# EAGLE design ctr_p1 (EAGLE 9.6.2)
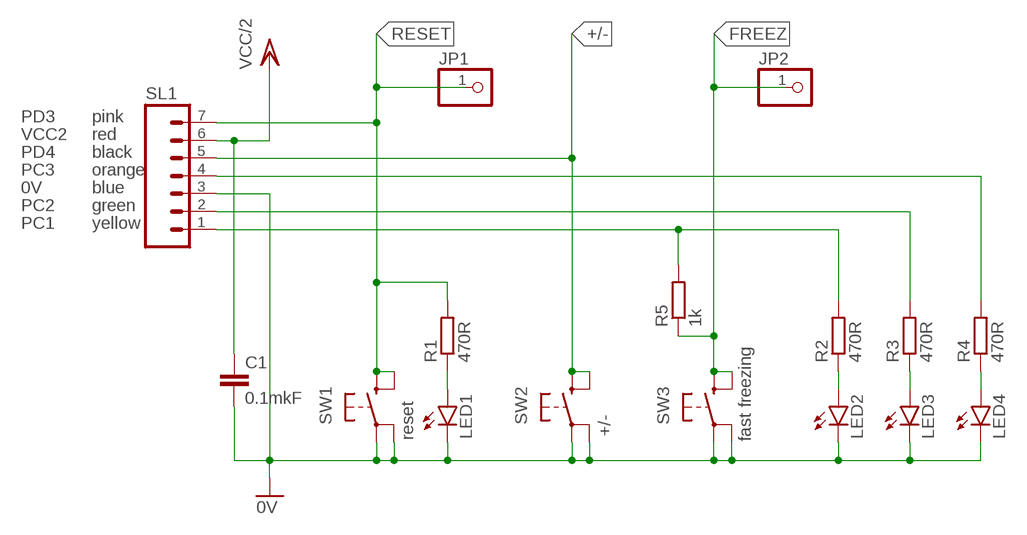
[diagram p0: schematic, sheet 1]

## Parts
C1  0.1mkF  C-EUC3225  [C3225]
JP1  PINHD-1X1  [1X01]
JP2  PINHD-1X1  [1X01]
LED1  LED3MM  [LED3MM]
LED2  LED3MM  [LED3MM]
LED3  LED3MM  [LED3MM]
LED4  LED3MM  [LED3MM]
R1  470R  R-EU_R0805  [R0805]
R2  470R  R-EU_R0805  [R0805]
R3  470R  R-EU_R0805  [R0805]
R4  470R  R-EU_R0805  [R0805]
R5  1k  R-EU_R0805  [R0805]
SL1  MA07  [07PA]
SW1  reset  PUSH_BUTTON_25X6MM  [SWITCH]
SW2  +/-  PUSH_BUTTON_25X6MM  [SWITCH]
SW3  fast freezing  PUSH_BUTTON_25X6MM  [SWITCH]

## Nets
0V: C1.2 LED1.K(C) LED2.K(C) LED3.K(C) LED4.K(C) SL1.3 SW1.P$1A(P) SW1.P$2A(P1) SW2.P$1A(P) SW2.P$2A(P1) SW3.P$1A(P) SW3.P$2A(P1)
+/-: SL1.5 SW2.P$1B(S) SW2.P$2B(S1)
FREEZ: JP2.1 R5.1 SW3.P$1B(S) SW3.P$2B(S1)
N$1: LED2.A R2.1
N$2: LED3.A R3.1
N$3: LED4.A R4.1
N$6: R2.2 R5.2 SL1.1
N$8: R3.2 SL1.2
N$9: R4.2 SL1.4
N$10: LED1.A R1.1
RESET: JP1.1 R1.2 SL1.7 SW1.P$1B(S) SW1.P$2B(S1)
VCC/2: C1.1 SL1.6

## Notes on the sheet
- PD3 | pink
- VCC2 | red
- PD4 | black
- PC3 | orange
- 0V | blue
- PC2 | green
- PC1 | yellow

## Library data of the parts
C1 = rcl:C-EU: CAPACITOR, European symbol; SPICEPREFIX: C
JP1 JP2 = pinhead:PINHD-1X1: PIN HEADER
LED1-LED4 = OU_USSR:LED: LED OSRAM: - CHIPLED LG R971, LG N971, LY N971, LG Q971, LY Q971, LO R971, LY R971 LH N974, LH R974 LS Q976, LO Q976, LY Q976 LO Q996 - Hyper CHIPLED LW Q18S LB Q993, LB Q99A, LB R99A - SideLED LS A670, LO A670, LY A670, LG A670, LP A670 LB A673, LV A673, LT A673, LW A673 LH A674 LY A675 LS A676, LA A676, LO A676, LY A676, LW A676 LS A679, LY A679, LG A679 - Hyper Micro SIDELED® LS Y876, LA Y876, LO Y876, LY Y876 LT Y87S - SmartLED LW L88C, LW L88S LB L89C, LB L89S, LG L890 LS L89K, LO L89K, LY L89K LS L896, LA L896, LO L896, LY L896 - TOPLED LS T670, LO T670, LY T670, LG T670, LP T670 LSG T670, LSP T670, LSY T670, LOP T670, LYG T670 LG T671, LOG T671, LSG T671 LB T673, LV T673, LT T673, LW T673 LH T674 LS T676, LA T676, LO T676, LY T676, LB T676, LH T676, LSB T676, LW T676 LB T67C, LV T67C, LT T67C, LS T67K, LO T67K, LY T67K, LW E67C LS E67B, LA E67B, LO E67B, LY E67B, LB E67C, LV E67C, LT E67C LW T67C LS T679, LY T679, LG T679 LS T770, LO T770, LY T770, LG T770, LP T770 LB T773, LV T773, LT T773, LW T773 LH T774 LS E675, LA E675, LY E675, LS T675 LS T776, LA T776, LO T776, LY T776, LB T776 LHGB T686 LT T68C, LB T68C - Hyper Mini TOPLED® LB M676 - Mini TOPLED Santana® LG M470 LS M47K, LO M47K, LY M47K Source: http://www.osram.convergy.de LUXEON: - LUMILED® LXK2-PW12-R00, LXK2-PW12-S00, LXK2-PW14-U00, LXK2-PW14-V00 LXK2-PM12-R00, LXK2-PM12-S00, LXK2-PM14-U00 LXK2-PE12-Q00, LXK2-PE12-R00, LXK2-PE12-S00, LXK2-PE14-T00, LXK2-PE14-U00 LXK2-PB12-K00, LXK2-PB12-L00, LXK2-PB12-M00, LXK2-PB14-N00, LXK2-PB14-P00, LXK2-PB14-Q00 LXK2-PR12-L00, LXK2-PR12-M00, LXK2-PR14-Q00, LXK2-PR14-R00 LXK2-PD12-Q00, LXK2-PD12-R00, LXK2-PD12-S00 LXK2-PH12-R00, LXK2-PH12-S00 LXK2-PL12-P00, LXK2-PL12-Q00, LXK2-PL12-R00 Source: www.luxeon.com KINGBRIGHT: KA-3528ASYC Source: www.kingbright.com
R1-R5 = rcl:R-EU_: RESISTOR, European symbol; SPICEPREFIX: R
SL1 = con-amp-quick:MA07: AMP QUICK CONNECTOR; OC_FARNELL: unknown; OC_NEWARK: unknown
SW1-SW3 = OU_USSR:PUSH_BUTTON_2: momentary push button

## Board
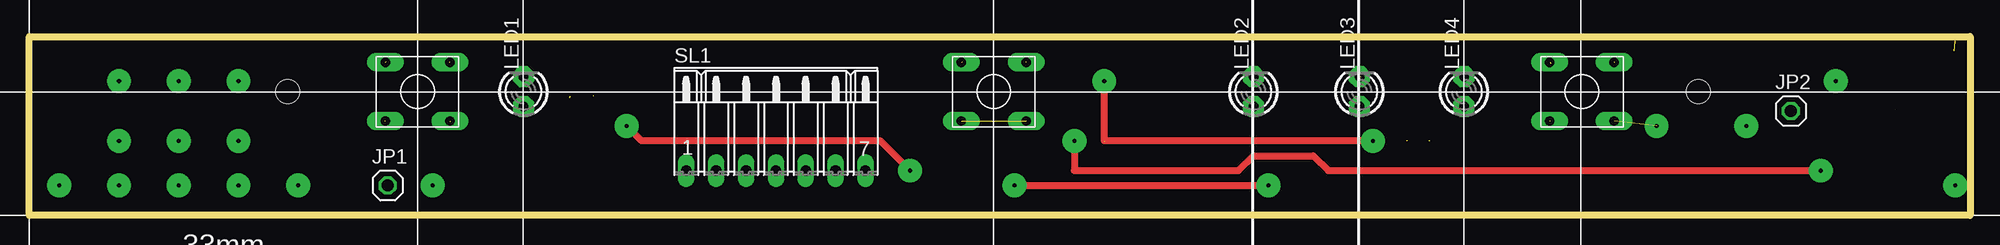
[diagram p1: board, top side]
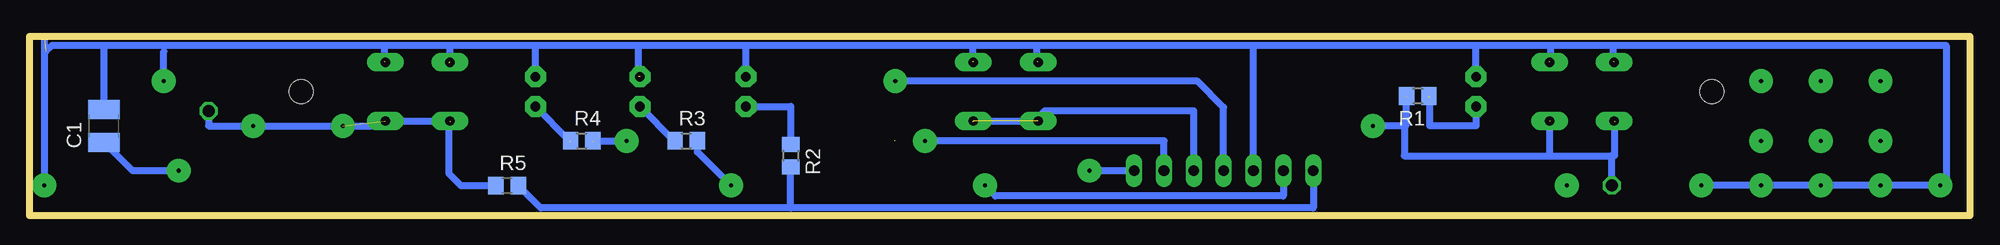
[diagram p2: board, bottom side, seen from below]

Size 165.1 x 15.24 mm. Coordinates in mm from the lower left corner, seen from the top.
Outline: 165.1,15.24 0,15.23 0,0
Outline: 165.1,15.24 0,15.24 0,0
Outline: 165.1,15.24 165.1,0 0,0
Copper layers (1*16): Top 0.035mm / dielectric 1.5mm / Bottom 0.035mm
Design rules "default": minimum track width 6mil, minimum drill 0.35mm, track to track 6mil, track to pad 6mil, pad to pad 6mil, via to via 6mil, smd to smd 6mil, copper to edge 40mil, drill to drill 6mil, minimum pad ring 10mil, minimum via ring 8mil, stop-mask expansion 4mil, vias tented up to drill 0mil, thermal gap 10mil
Holes 2.03 mm at 21.97,10.54 141.99,10.54

### Footprints (pad centres in the part's own frame; a part is rotated, then mirrored left to right if it is on the bottom)
C3225 = smd 1.6 x 2.7: 1 -1.4,0; 2 1.4,0
1X01 = drill 1.016 octagon: 1 0,0
LED3MM = drill 0.813 pad 1.778 octagon: A -1.27,0; K 1.27,0
R0805 = smd 1.3 x 1.5: 1 -0.95,0; 2 0.95,0
07PA = drill 0.914 long: 1 -7.62,0; 2 -5.08,0; 3 -2.54,0; 4 0,0; 5 2.54,0; 6 5.08,0; 7 7.62,0
SWITCH = drill 0.8 pad 1.575 long: P$1A -2.75,2.5; P$1B -2.75,-2.5; P$2A 2.75,2.5; P$2B 2.75,-2.5

### Placement (x,y rotation side)
C1  158.75,7.62 90 bottom
JP1  30.48,2.54 0 top
JP2  149.86,8.89 0 top
LED1  42.04,10.54 90 top
LED2  104.14,10.54 90 top
LED3  113.16,10.54 90 top
LED4  122.05,10.54 90 top
R1  46.99,10.16 180 bottom
R2  100.33,5.08 270 bottom
R3  109.22,6.35 0 bottom
R4  118.11,6.35 0 bottom
R5  124.46,2.54 0 bottom
SL1  63.5,3.81 0 top
SW1  33.02,10.54 0 top
SW2  82.04,10.54 0 top
SW3  132.08,10.54 0 top

### Tracks (layer width: path | path; a pad name or v marks a point on that pad's centre or on a via)
0V  (via drill 0.35 pad 2.03)  (9 unrouted)
  Bottom 0.61: 30.35,14.48 2.03,14.48 2.03,2.54 v2.54,2.54 v7.62,2.54 v12.7,2.54 v17.78,2.54 v22.86,2.54 | 30.35,14.48 35.69,14.48 | 35.69,14.48 42.04,14.48 | 42.04,14.48 60.96,14.48 | 60.96,14.48 79.38,14.48 | 79.38,14.48 84.84,14.48 | 84.84,14.48 104.14,14.48 | 104.14,14.48 113.28,14.48 | 113.28,14.48 122.05,14.48 | 122.05,14.48 129.29,14.48 | 129.29,14.48 134.87,14.48 | 134.87,14.48 158.75,14.48 | 158.75,14.48 163.19,14.48 163.7,13.97 | LED1.K 42.04,14.48 | LED2.K 104.14,14.48 | 113.28,11.81 113.28,14.48 | LED4.K 122.05,14.48 | 30.35,13.08 30.35,14.48 | 35.81,13.08 35.69,13.21 35.69,14.48 | 79.38,13.08 79.38,14.48 | 84.84,13.08 84.84,14.48 | 129.41,12.95 129.29,13.08 129.29,14.48 | 134.87,13.08 134.87,14.48 | SL1.3 60.96,14.48 | C1.2 158.75,14.48 | 163.83,15.24 v163.83,2.54
+/-  (2 unrouted)
  Bottom 0.61: SL1.5 66.04,8.89 78.74,8.89 79.38,8.26 79.38,8 84.84,8
FREEZ  (via drill 0.35 pad 2.03)  (2 unrouted)
  Bottom 0.61: JP2.1 149.86,7.62 v146.05,7.62 v138.43,7.62 135.25,7.62 134.87,8 129.41,8 | 129.29,8 129.41,8 | 129.41,8 129.41,3.56 128.4,2.54 R5.1
N$1
  Bottom 0.61: LED2.A 100.33,9.27 R2.1
N$2
  Bottom 0.61: LED3.A 110.24,6.35 R3.1
N$3  (1 unrouted)
  Bottom 0.61: 119.13,6.35 119,6.48 119.25,6.48 LED4.A
N$4  (via drill 0.35 pad 2.03)
  Bottom 0.61: v153.67,11.43 153.67,13.97
N$5  (via drill 0.35 pad 2.03)
  other vias: 34.29,2.54
N$6
  Bottom 0.61: SL1.1 55.88,0.64 100.33,0.64 | 100.33,0.64 121.61,0.64 R5.2 | 100.33,0.64 R2.2
N$7  (via drill 0.35 pad 2.03)
  other vias: 7.62,11.43
N$8  (via drill 0.35 pad 2.03)
  Top 0.61: v83.82,2.54 v105.41,2.54
  Bottom 0.61: SL1.2 58.42,1.65 82.93,1.65 v83.82,2.54 | v105.41,2.54 108.27,5.4 R3.2
N$9  (via drill 0.35 pad 2.03)  (2 unrouted)
  Top 0.61: v114.3,6.35 91.49,6.35 | 91.44,6.35 v91.44,11.43
  Bottom 0.61: 117.22,6.35 v114.3,6.35 | SL1.4 63.5,9.21 65.72,11.43 v91.44,11.43
N$10  (1 unrouted)
  Bottom 0.61: LED1.A 42.04,7.62 42.16,7.62 45.97,7.62 45.97,10.03
N$11  (via drill 0.35 pad 2.03)
  other vias: 12.7,11.43
N$12  (via drill 0.35 pad 2.03)
  other vias: 17.78,11.43
N$13  (via drill 0.35 pad 2.03)
  other vias: 7.62,6.35
N$14  (via drill 0.35 pad 2.03)
  other vias: 12.7,6.35
N$15  (via drill 0.35 pad 2.03)
  other vias: 17.78,6.35
RESET  (via drill 0.35 pad 2.03)  (3 unrouted)
  Top 0.61: v50.8,7.62 52.07,6.35 72.39,6.35 v74.93,3.81
  Bottom 0.61: 48.01,10.16 48.01,7.62 48.13,7.62 | 48.13,7.62 v50.8,7.62 | v74.93,3.81 SL1.7 | 48.13,7.62 48.13,5.08 35.81,5.08 | 35.81,5.08 30.48,5.08 | 30.48,5.08 30.23,5.08 30.23,8 | 35.81,8 35.81,5.08 | JP1.1 30.48,5.08
VCC/2  (via drill 0.35 pad 2.03)
  Top 0.61: v88.9,6.35 88.9,3.81 102.87,3.81 104.14,5.08 109.22,5.08 110.49,3.81 v152.4,3.81
  Bottom 0.61: SL1.6 68.58,6.35 v88.9,6.35 | C1.1 156.34,3.81 v152.4,3.81